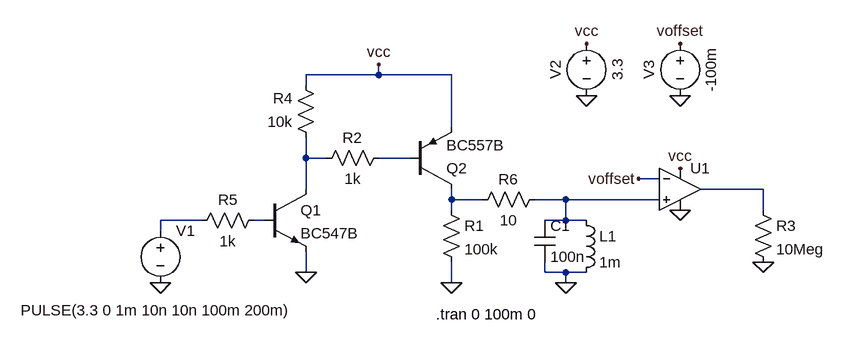
[diagram p0: schematic Step-Resonance.asc]
Step-Resonance.asc, the LTspice schematic file:
Version 4
SHEET 1 880 680
WIRE 0 -96 0 -112
WIRE 0 -96 -112 -96
WIRE 112 -96 0 -96
WIRE -112 -80 -112 -96
WIRE 112 -16 112 -96
WIRE -112 32 -112 0
WIRE -80 32 -112 32
WIRE 48 32 0 32
WIRE 432 64 400 64
WIRE -112 80 -112 32
WIRE 592 80 496 80
WIRE 112 96 112 80
WIRE 160 96 112 96
WIRE 288 96 240 96
WIRE 432 96 288 96
WIRE 112 112 112 96
WIRE 592 112 592 80
WIRE -272 128 -336 128
WIRE -176 128 -192 128
WIRE 288 128 288 96
WIRE 288 128 256 128
WIRE 320 128 288 128
WIRE -336 144 -336 128
WIRE -112 208 -112 176
WIRE 256 208 256 192
WIRE 288 208 256 208
WIRE 320 208 288 208
WIRE 112 224 112 192
WIRE 288 224 288 208
FLAG 288 224 0
FLAG -336 224 0
FLAG 464 112 0
FLAG 320 -64 0
FLAG 592 192 0
FLAG 464 -64 0
FLAG 320 -144 vcc
FLAG 464 -144 voffset
FLAG 464 48 vcc
FLAG 400 64 voffset
FLAG 112 224 0
FLAG 0 -112 vcc
FLAG -112 208 0
SYMBOL voltage -336 128 R0
WINDOW 3 -215 138 Left 2
WINDOW 123 0 0 Left 0
WINDOW 39 0 0 Left 0
SYMATTR Value PULSE(3.3 0 1m 10n 10n 100m 200m)
SYMATTR InstName V1
SYMBOL cap 240 128 R0
SYMATTR InstName C1
SYMATTR Value 100n
SYMATTR SpiceLine V=25 Rser=100m
SYMBOL ind 304 112 R0
SYMATTR InstName L1
SYMATTR Value 1m
SYMATTR SpiceLine Rser=100m
SYMBOL OpAmps\\UniversalOpAmp2 464 80 R0
SYMATTR InstName U1
SYMBOL voltage 320 -160 R0
WINDOW 0 -32 56 VBottom 2
WINDOW 3 32 56 VTop 2
WINDOW 123 0 0 Left 0
WINDOW 39 0 0 Left 0
SYMATTR InstName V2
SYMATTR Value 3.3
SYMBOL res 576 96 R0
SYMATTR InstName R3
SYMATTR Value 10Meg
SYMBOL voltage 464 -160 R0
WINDOW 0 -32 56 VBottom 2
WINDOW 3 32 56 VTop 2
WINDOW 123 0 0 Left 0
WINDOW 39 0 0 Left 0
SYMATTR InstName V3
SYMATTR Value -100m
SYMBOL pnp 48 80 M180
SYMATTR InstName Q2
SYMATTR Value BC557B
SYMBOL res 96 96 R0
SYMATTR InstName R1
SYMATTR Value 100k
SYMBOL res 16 16 R90
WINDOW 0 0 56 VBottom 2
WINDOW 3 32 56 VTop 2
SYMATTR InstName R2
SYMATTR Value 1k
SYMBOL res -96 16 R180
WINDOW 0 36 76 Left 2
WINDOW 3 36 40 Left 2
SYMATTR InstName R4
SYMATTR Value 10k
SYMBOL res -288 144 R270
WINDOW 0 32 56 VTop 2
WINDOW 3 0 56 VBottom 2
SYMATTR InstName R5
SYMATTR Value 1k
SYMBOL npn -176 80 R0
SYMATTR InstName Q1
SYMATTR Value BC547B
SYMBOL res 256 80 R90
WINDOW 0 0 56 VBottom 2
WINDOW 3 32 56 VTop 2
SYMATTR InstName R6
SYMATTR Value 10
TEXT 88 272 Left 2 !.tran 0 100m 0

The netlist it stands for:
* Step-Resonance.asc
V1 N006 0 PULSE(3.3 0 1m 10n 10n 100m 200m)
C1 N005 0 100n V=25 Rser=100m
L1 N005 0 1m Rser=100m
XU1 N005 voffset vcc 0 N003 level2 Avol=1Meg GBW=10Meg Slew=10Meg Ilimit=25m Rail=0 Vos=0 En=0 Enk=0 In=0 Ink=0 Rin=500Meg  ; pins In+ In- V+ V- OUT
V2 vcc 0 3.3
R3 N003 0 10Meg
V3 voffset 0 -100m
Q2 N004 N002 vcc 0 BC557B
R1 N004 0 100k
R2 N002 N001 1k
R4 N001 vcc 10k
R5 N006 N007 1k
Q1 N001 N007 0 0 BC547B
R6 N005 N004 10
.model NPN NPN
.model PNP PNP
.lib standard.bjt
.tran 0 100m 0
.lib UniversalOpAmp2.lib
.backanno
.end